# Altium schematic sheet MixerHF.SchDoc
size A4
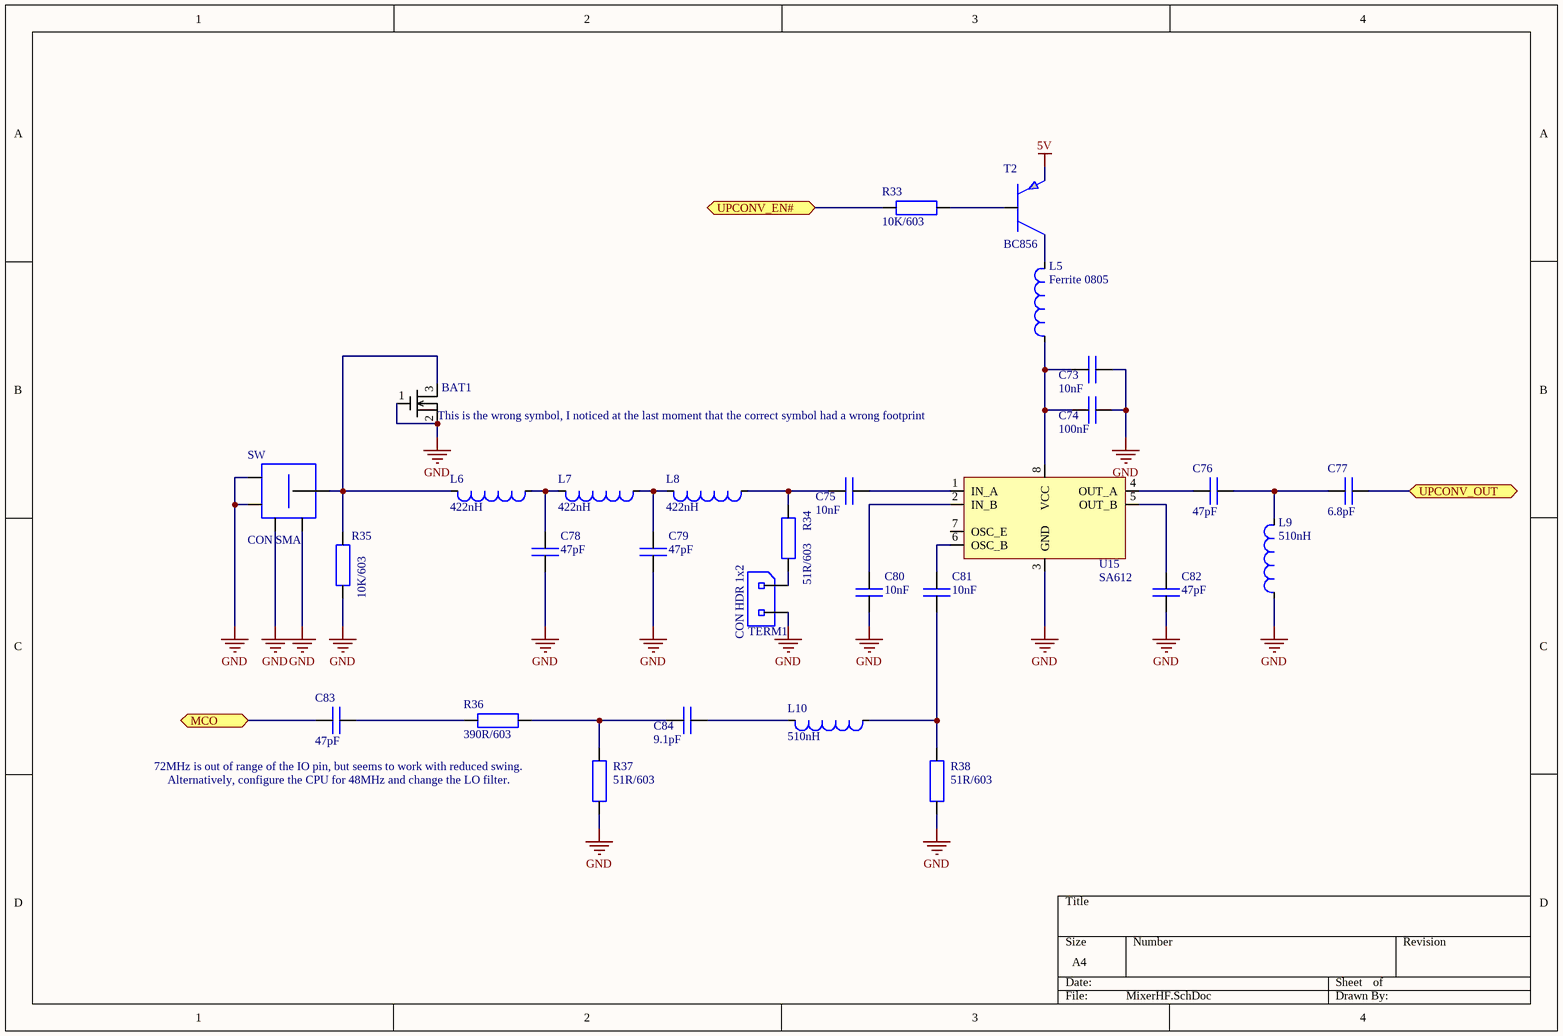
[diagram p0: MixerHF.SchDoc]

## Parts
BAT1  (no value)  [SOT95P230X110-3N]
C73  10nF  [smd C0603_0.80]
C74  100nF  [smd C0603_0.80]
C75  10nF  [smd C0603_0.80]
C76  47pF  [smd C0603_0.80]
C77  6.8pF  [smd C0603_0.80]
C78  47pF  [smd C0603_0.80]
C79  47pF  [smd C0603_0.80]
C80  10nF  [smd C0603_0.80]
C81  10nF  [smd C0603_0.80]
C82  47pF  [smd C0603_0.80]
C83  47pF  [smd C0603_0.80]
C84  9.1pF  [smd C0603_0.80]
L5  Ferrite 0805  [smd C0805]
L6  422nH  [smd C0805]
L7  422nH  [smd C0805]
L8  422nH  [smd C0805]
L9  510nH  [smd C0805]
L10  510nH  [smd C0805]
R33  10K/603  [smd C0603_0.45]
R34  51R/603  [smd C0603_0.45]
R35  10K/603  [smd C0603_0.45]
R36  390R/603  [smd C0603_0.45]
R37  51R/603  [smd C0603_0.45]
R38  51R/603  [smd C0603_0.45]
SW  CON SMA  [con SMA (recht)]
T2  BC856  [smd SOT-23]
TERM1  CON HDR 1x2  [hdr 1x2]
U15  SA612  [SOIC127P600X175-8N]

## Ports
MCO, UPCONV_EN#, UPCONV_OUT

## Nets
5V: T2.2
GND: BAT1.1(G) BAT1.2(S) C73.1 C74.1 C78.1 C79.1 C80.2 C82.1 L9.1 R35.1 R37.2 R38.2 SW.2 SW.3 SW.4 SW.5 TERM1.2 U15.3(GND)
MCO: C83.2 ; port MCO
UPCONV_EN#: R33.1 ; port UPCONV_EN#
UPCONV_OUT: C77.2 ; port UPCONV_OUT
NetBAT1_3: BAT1.3(D) L6.2 R35.2 SW.1
NetC73_2: C73.2 C74.2 L5.1 U15.8(VCC)
NetC75_1: C75.1 U15.1(IN_A)
NetC75_2: C75.2 L8.1 R34.2
NetC76_1: C76.1 U15.4(OUT_A)
NetC76_2: C76.2 C77.1 L9.2
NetC78_2: C78.2 L6.1 L7.2
NetC79_2: C79.2 L7.1 L8.2
NetC80_1: C80.1 U15.2(IN_B)
NetC81_1: C81.1 U15.6(OSC_B)
NetC81_2: C81.2 L10.1 R38.1
NetC82_2: C82.2 U15.5(OUT_B)
NetC83_1: C83.1 R36.2
NetC84_1: C84.1 L10.2
NetC84_2: C84.2 R36.1 R37.1
NetL5_2: L5.2 T2.3
NetR33_2: R33.2 T2.1
NetR34_1: R34.1 TERM1.1

Not connected (* = marked no-connect by the designer): U15 7(OSC_E)

## Notes on the sheet
- (near BAT1) This is the wrong symbol, I noticed at the last moment that the correct symbol had a wrong footprint
- (near R37) 72MHz is out of range of the IO pin, but seems to work with reduced swing.
- (near R37) Alternatively, configure the CPU for 48MHz and change the LO filter.

## Library data of the parts
BAT1 = NX3008NBK
C73-C75 C80 C81 C84 = CSMD603/100nF: smd capaciteit, verp.0603, 100nF; Part Number: CSMD603/100nF; Component Kind: Standard; Component Type: Standard; Designator: CSMD603/100nF; Pin Count: 2; Supplier 1: Farnell
C76-C79 C82 C83 = CSMD603/10pF: smd capaciteit, verp.0603, 10pF; Part Number: CSMD603/10pF; Component Kind: Standard; Component Type: Standard; Designator: CSMD603/10pF; Pin Count: 2; Supplier 1: Farnell
L5 = Ferrite 0805: Ferrite bead, 0805 package; Supplier 1: Farnell
L6-L10 = SPL805/250nH: smd spoel, verpakking 805, 250nH; Component Kind: Standard; Supplier 1: Farnell
R33 R35 = 10K/603: weerstand SMD603, 10K; Supplier 1: Farnell
R34 R37 R38 = 51R/603: weerstand SMD603, 51R; Supplier 1: Farnell
R36 = 390R/603: weerstand SMD603, 390R; Supplier 1: Farnell
SW = CON SMA: SMA connector, rechtop; Part Number: CON SMA; Component Kind: Standard; Component Type: Standard; Designator: CON SMA; Pin Count: 5; Supplier 1: Farnell
T2 = BC856: PNP transistor, smd; Supplier 1: Farnell
TERM1 = CON HDR 1x2: pcb header recht 1x2  pitch 100mil; Part Number: CON HDR 1x2; Component Kind: Standard; Component Type: Standard; Designator: CON HDR 1x2; Pin Count: 2; Supplier 1: Farnell